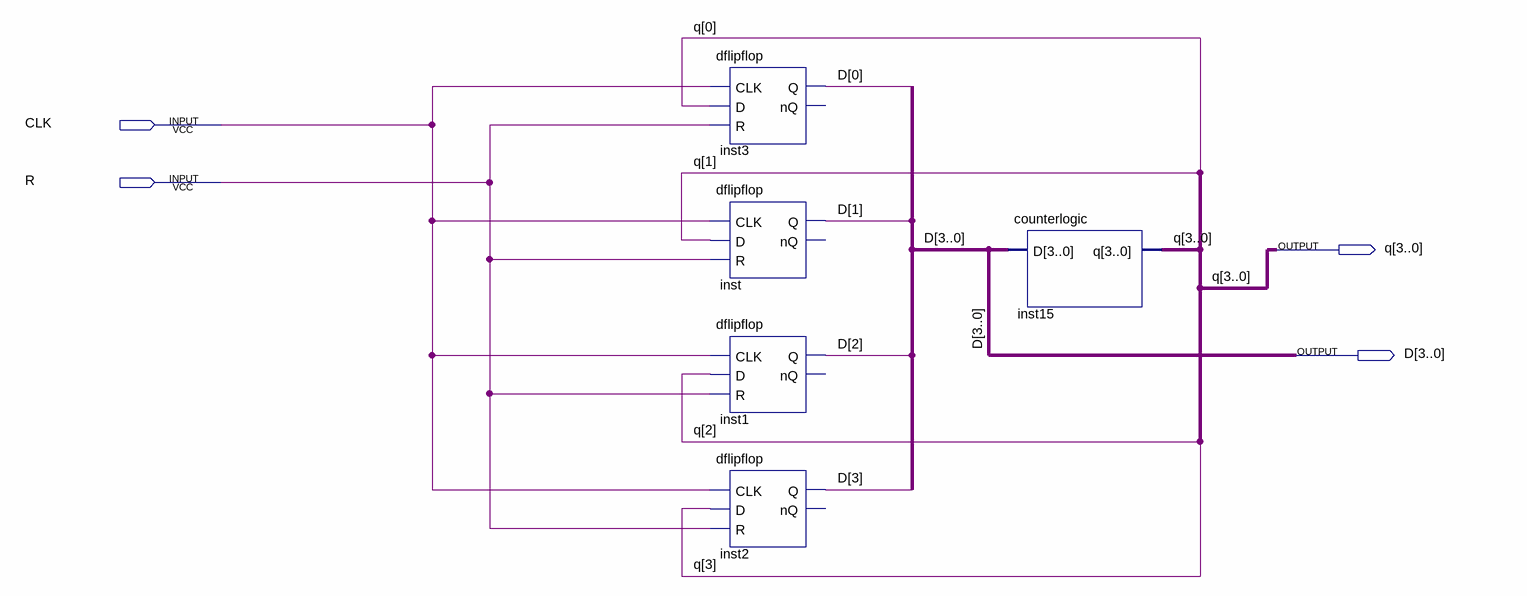
[diagram p0: schematic sheet]
// Quartus schematic fourbitflip.bdf as structural Verilog: 5 symbols, 4 pins
module fourbitflip (
  input  CLK,
  input  R,
  output [3:0] q,
  output [3:0] D
);

  dflipflop inst3 (.CLK(CLK), .D(q[0]), .R(R), .Q(D[0]));  // open: nQ
  dflipflop inst (.CLK(CLK), .D(q[1]), .R(R), .Q(D[1]));  // open: nQ
  dflipflop inst1 (.CLK(CLK), .D(q[2]), .R(R), .Q(D[2]));  // open: nQ
  dflipflop inst2 (.CLK(CLK), .D(q[3]), .R(R), .Q(D[3]));  // open: nQ
  counterlogic inst15 (.D(D), .q(q));
endmodule
